# EAGLE design tinybridge-12mbps (EAGLE 8.3.2)
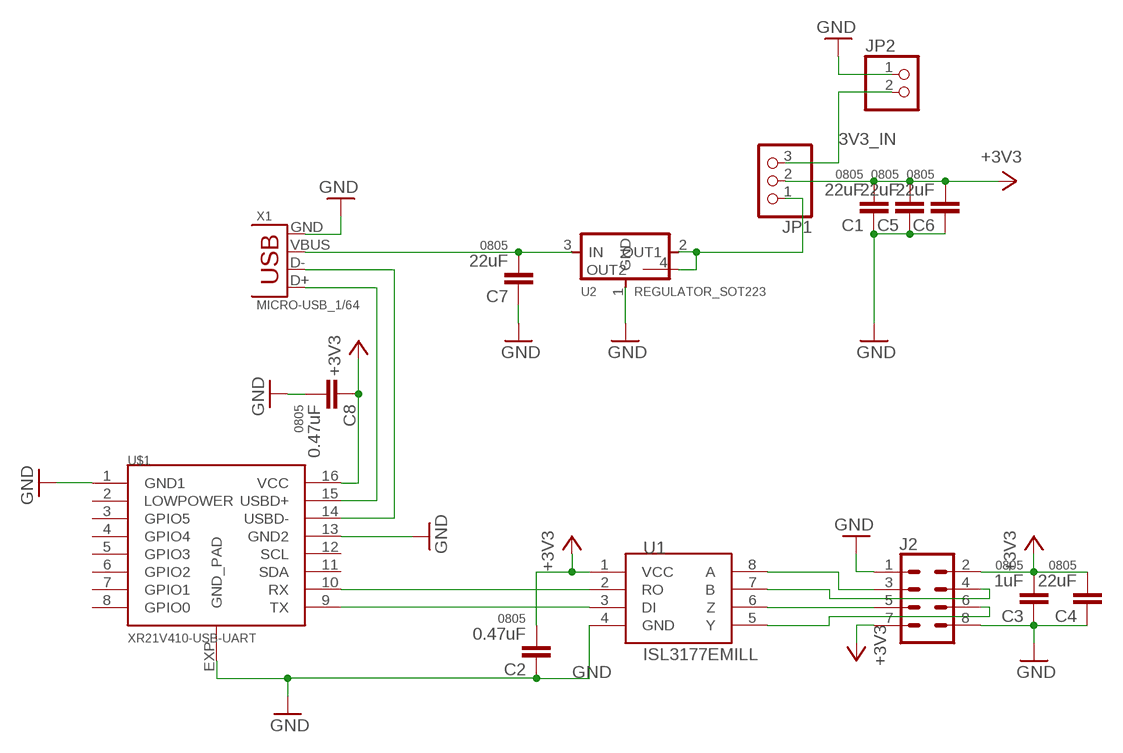
[diagram p0: schematic, sheet 1]

## Parts
C1  22uF  CAP0805  [0805]
C2  0.47uF  CAP0805  [0805]
C3  1uF  CAP0805  [0805]
C4  22uF  CAP0805  [0805]
C5  22uF  CAP0805  [0805]
C6  22uF  CAP0805  [0805]
C7  22uF  CAP0805  [0805]
C8  0.47uF  CAP0805  [0805]
J2  CONN_04X2SHROUDED-SQUISH  [2X4-SHROUDED-SQUISH]
JP1  PINHD-1X3  [1X03]
JP2  PINHD-1X2  [1X02]
U1  ISL3177EMILL  [MSOP8-8MILPADS]
U2  REGULATOR_SOT223  [SOT223]
U$1  XR21V410-USB-UART  [QFN-16-3X3-1-100]
X1  MICRO-USB_1/64  [DX4R005HJ5_64]

## Nets
3V3_IN: JP1.3 JP2.2
+3V3: C1.2 C2.2 C3.2 C4.2 C5.2 C6.2 C8.1 J2.2 J2.7 JP1.2 U1.1(VCC) U$1.16(VCC)
GND: C1.1 C2.1 C3.1 C4.1 C5.1 C6.1 C7.1 C8.2 J2.1 J2.8 JP2.1 U1.4(GND) U2.1(GND) U$1.1(GND1) U$1.13(GND2) U$1.EXP(GND_PAD) X1.GND
N$1: U1.2(RO) U$1.10(RX)
N$2: U1.3(DI) U$1.9(TX)
N$4: J2.3 U1.8(A)
N$5: J2.4 U1.7(B)
N$6: J2.5 U1.6(Z)
N$7: J2.6 U1.5(Y)
N$8: U$1.15(USBD+) X1.D+
N$9: U$1.14(USBD-) X1.D-
N$10: C7.2 U2.3(IN) X1.VBUS
N$11: JP1.1 U2.2(OUT1) U2.4(OUT2)
Unconnected: U$1.2(LOWPOWER) U$1.3(GPIO5) U$1.4(GPIO4) U$1.5(GPIO3) U$1.6(GPIO2) U$1.7(GPIO1) U$1.8(GPIO0) U$1.11(SDA) U$1.12(SCL)

## Library data of the parts
C1-C8 = borkedlabs-passives:CAP: Capacitor Standard 0603 ceramic capacitor, and 0.1" leaded capacitor.; PACKAGE: 0805
J2 = fab:CONN_04X2: Multi connection point. Often used as Generic Header-pin footprint for 0.1 inch spaced/style header connections On any of the 0.1 inch spaced packages, you can populate with these: Break Away Headers - Straight <https://www.sparkfun.com/products/116> (PRT-00116) Break Away Male Headers - Right Angle <https://www.sparkfun.com/products/553> (PRT-00553) Female Headers <https://www.sparkfun.com/products/115> (PRT-00115) Break Away Headers - Machine Pin <https://www.sparkfun.com/products/117> (PRT-00117) Break Away Female Headers - Swiss Machine Pin <https://www.sparkfun.com/products/743> (PRT-00743)
JP1 = pinhead:PINHD-1X3: PIN HEADER
JP2 = pinhead:PINHD-1X2: PIN HEADER
U1 = fab:ISL3177E
U2 = fab:REGULATOR_SOT223
U$1 = fab:XR21V410-USB-UART
X1 = fab:MICRO-USB: SMD micro USB connector as found in the fablab inventory. Three footprint variants included: original, as described by manufacturer's datasheet for milling with the 1/100" bit for milling with the 1/64" bit Made by Zaerc.

## Board
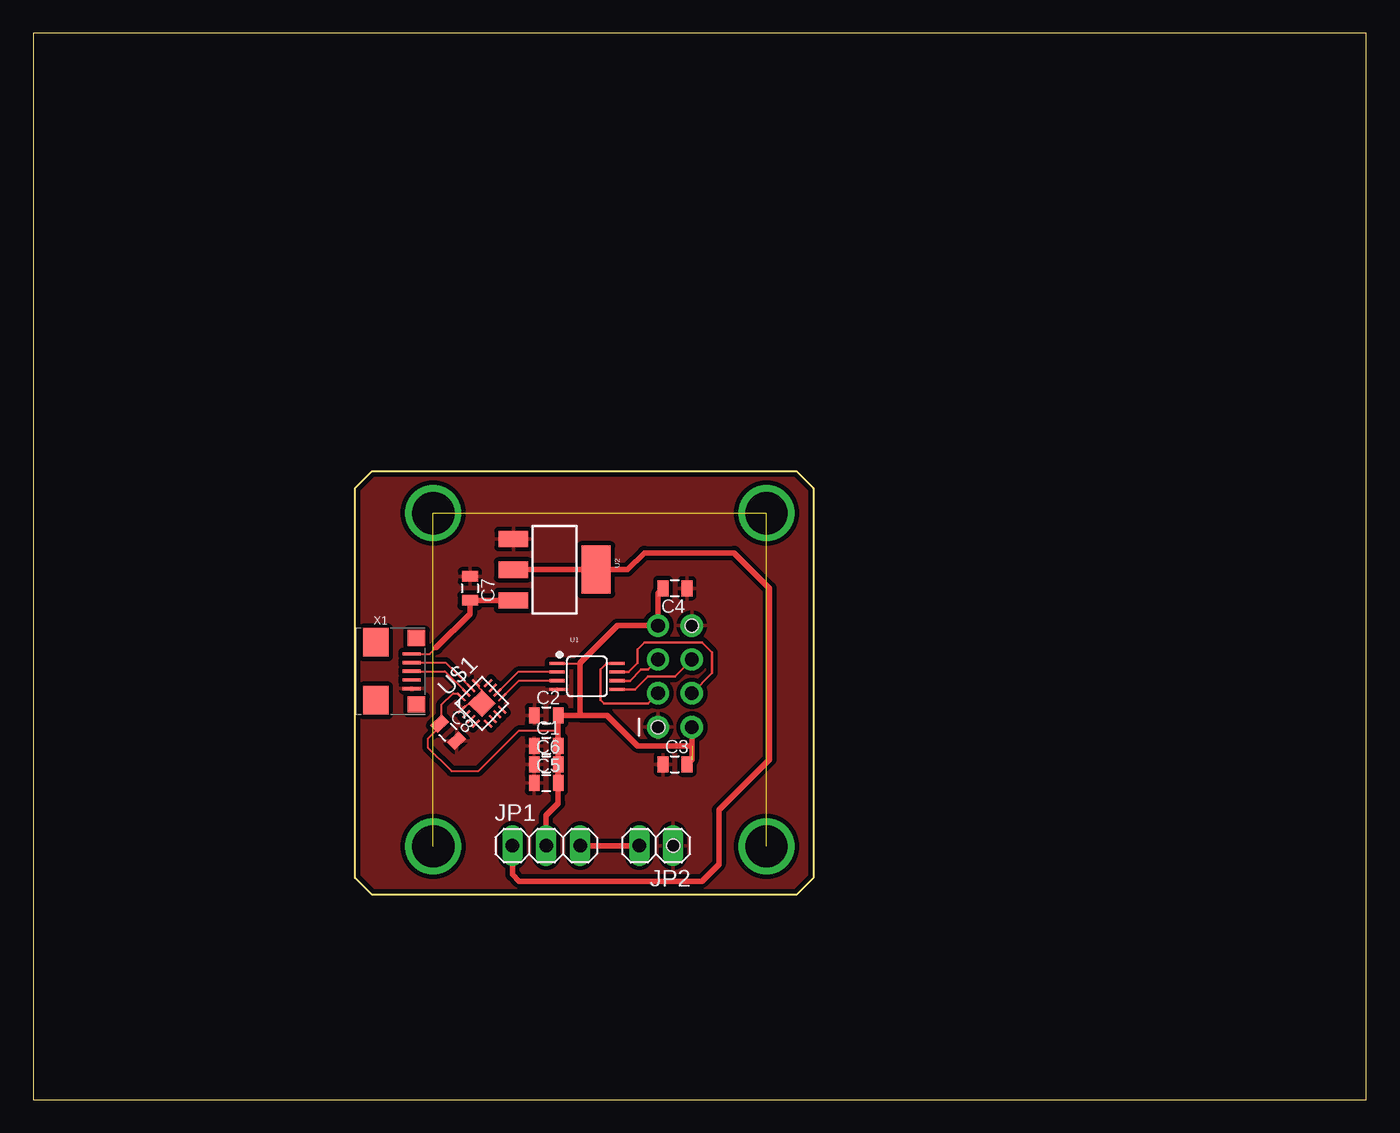
[diagram p1: board, top side]
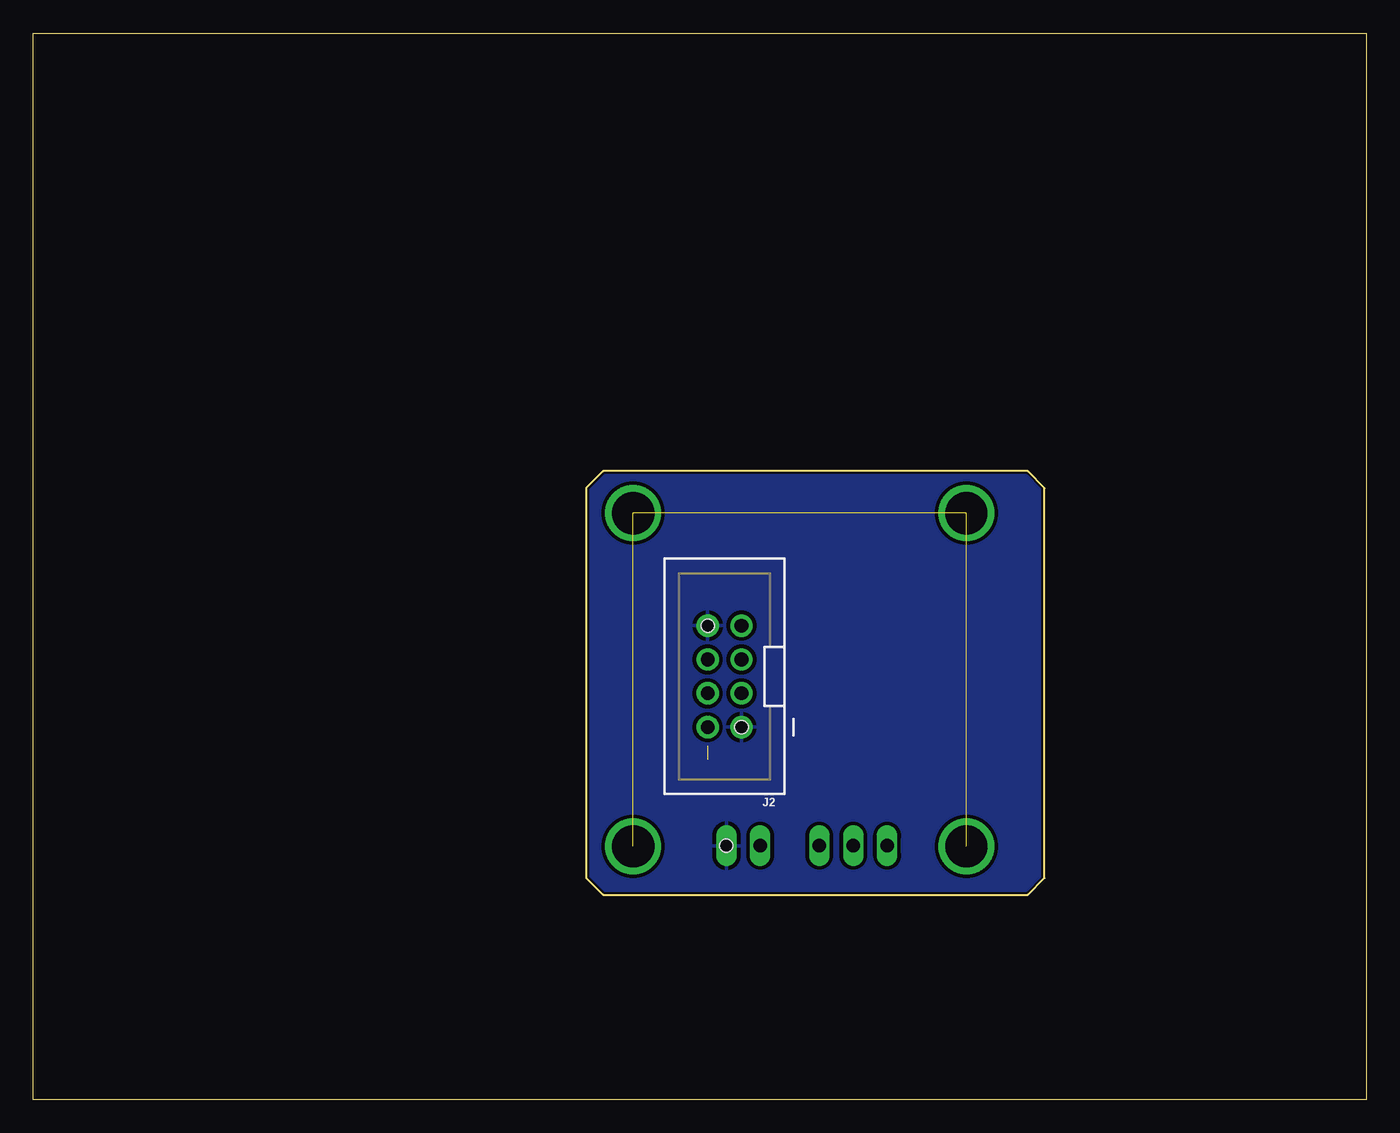
[diagram p2: board, bottom side, seen from below]

Size 100 x 80 mm. Coordinates in mm from the lower left corner, seen from the top.
Outline: 0,0 100,0 100,80 0,80 0,0
Outline: 24.13,45.87 25.4,47.14 57.24,47.14 58.51,45.87 58.51,16.63 57.24,15.36 25.4,15.36 24.13,16.63 24.13,45.87
Copper layers (1*16): Top 0.035mm / dielectric 1.5mm / Bottom 0.035mm
Design rules "default *": minimum track width 7mil, minimum drill 0.83mm, track to track 11mil, track to pad 11mil, pad to pad 11mil, via to via 11mil, smd to smd 11mil, copper to edge 6mil, drill to drill 12mil, minimum pad ring 10mil, minimum via ring 8mil, stop-mask expansion 4mil, vias tented up to drill 0mil, thermal gap 12mil
Holes 1 mm at 46.86,27.94 49.4,35.56 48.01,19.05

### Footprints (pad centres in the part's own frame; a part is rotated, then mirrored left to right if it is on the bottom)
0805 = smd 0.8 x 1.2: 1 -0.9,0; 2 0.9,0
2X4-SHROUDED-SQUISH = drill 1.016 pad 1.676: 1 -1.27,2.54; 2 1.27,2.54; 3 -1.27,0; 4 1.27,0; 5 -1.27,-2.54; 6 1.27,-2.54; 7 -1.27,-5.08; 8 1.27,-5.08
1X03 = drill 1.016 long: 1 -2.54,0; 2 0,0; 3 2.54,0
1X02 = drill 1.016 long: 1 -1.27,0; 2 1.27,0
MSOP8-8MILPADS = smd 0.229 x 1.143: 1 -0.975,-2.25; 2 -0.325,-2.25; 3 0.325,-2.25; 4 0.975,-2.25; 5 0.975,2.25; 6 0.325,2.25; 7 -0.325,2.25; 8 -0.975,2.25
SOT223 = smd 1.219 x 2.235: 1 -2.311,-3.099; 2 0,-3.099; 3 2.311,-3.099 | smd 3.6 x 2.2: 4 0,3.099
QFN-16-3X3-1-100 = smd 0.762 x 0.152: 1 -1.4,0.75; 2 -1.4,0.25; 3 -1.4,-0.25; 4 -1.4,-0.75; 9 1.4,-0.75; 10 1.4,-0.25; 11 1.4,0.25; 12 1.4,0.75 | smd 0.152 x 0.762: 5 -0.75,-1.4; 6 -0.25,-1.4; 7 0.25,-1.4; 8 0.75,-1.4; 13 0.75,1.4; 14 0.25,1.4; 15 -0.25,1.4; 16 -0.75,1.4 | smd 1.45 x 1.45: EXP 0,0
DX4R005HJ5_64 = smd 0.254 x 1.35: D+ 0,1.6; D- -0.65,1.6; GND 1.3,1.6; ID 0.65,1.6; VBUS -1.3,1.6 | smd 1.2 x 1.3: GND@1 -2.5,1.95; GND@2 2.5,1.95 | smd 2.15 x 1.9: GND@3 -2.175,-1.1; GND@4 2.175,-1.1

### Placement (x,y rotation side)
C1  38.48,26.54 0 top
C2  38.49,28.83 0 top
C3  48.14,25.15 0 top
C4  48.14,38.35 180 top
C5  38.48,23.75 0 top
C6  38.48,25.15 0 top
C7  32.77,38.35 270 top
C8  31.11,27.56 315 top
J2  48.14,30.48 180 bottom
JP1  38.48,19.05 0 top
JP2  46.74,19.05 180 top
U1  41.54,31.75 270 top
U2  39.12,39.75 270 top
U$1  33.66,29.72 45 top
X1  26.8,32.13 270 top

### Tracks (layer width: path | path; a pad name or v marks a point on that pad's centre or on a via)
3V3_IN
  Top 0.406: JP2.2 JP1.3
+3V3  (1 unrouted)
  Top 0.152: U$1.16 31.83,30.48 31.5,30.48 30.61,29.59 30.61,28.32 C8.1 30.48,27.94 29.59,27.05 29.59,26.42 31.37,24.64 33.4,24.64 36.45,27.69 39.25,27.69 39.38,27.56 | U1.1 40.98,32.73 41.02,32.77
  Top 0.406: JP1.2 38.48,21.34 39.37,22.23 39.37,23.74 C5.2 C6.2 C1.2 39.38,27.56 39.38,27.93 C2.2 41.02,28.83 | 41.02,28.83 43.05,28.83 45.34,26.54 49.41,26.54 | J2.2 49.41,25.52 C3.2 | C4.2 46.87,37.98 J2.7 43.81,35.56 41.02,32.77 41.02,28.83
GND
  Top 0.102: U$1.1 32.4,29.52 32.49,29.52 32.68,29.72 U$1.EXP 33.66,30.69 33.46,30.89 33.46,30.97 U$1.13
  Top 0.152: 33.66,30.62 U$1.EXP
  pour Top (isolate 0.33): 24.13,45.87 25.4,47.14 57.24,47.14 58.51,45.87 58.51,16.63 57.24,15.36 25.4,15.36 24.13,16.63
  pour Bottom: 24.13,45.87 25.4,47.14 57.24,47.14 58.51,45.87 58.51,16.63 57.24,15.36 25.4,15.36 24.13,16.63
N$1
  Top 0.152: U1.2 36.37,32.08 U$1.10
N$2
  Top 0.152: U1.3 36.42,31.43 U$1.9
N$3  (via drill 3.17)  (3 unrouted)
  other vias: 30,44 55,44 55,19 30,19
N$4
  Top 0.203: U1.8 43.02,32.73 42.55,32.26 42.55,29.97 42.81,29.72 46.11,29.72 J2.3
N$5
  Top 0.203: U1.7 44.66,32.08 45.35,32.77 45.35,33.78 45.85,34.29 50.17,34.29 50.93,33.53 50.93,32 J2.4
N$6
  Top 0.203: U1.6 44.77,31.43 45.6,32.26 46.11,32.26 J2.5
N$7
  Top 0.203: U1.5 45.13,30.77 46.11,31.75 48.14,31.75 J2.6
N$8
  Top 0.152: X1.D+ 30.89,32.13 U$1.15
N$9
  Top 0.152: X1.D- 30.95,32.78 U$1.14
N$10
  Top 0.152: X1.VBUS 29.75,33.43 30.23,33.91
  Top 0.406: U2.3 C7.2 32.77,36.45 30.23,33.91
N$11
  Top 0.406: U2.2 U2.4 44.58,39.75 45.85,41.02 52.58,41.02 55.24,38.35 55.24,25.53 51.44,21.72 51.44,17.65 50.16,16.38 36.45,16.38 35.94,16.89 JP1.1